# EAGLE schematic Circuit_Board_HM_1007_Interface (EAGLE 9.6.2)
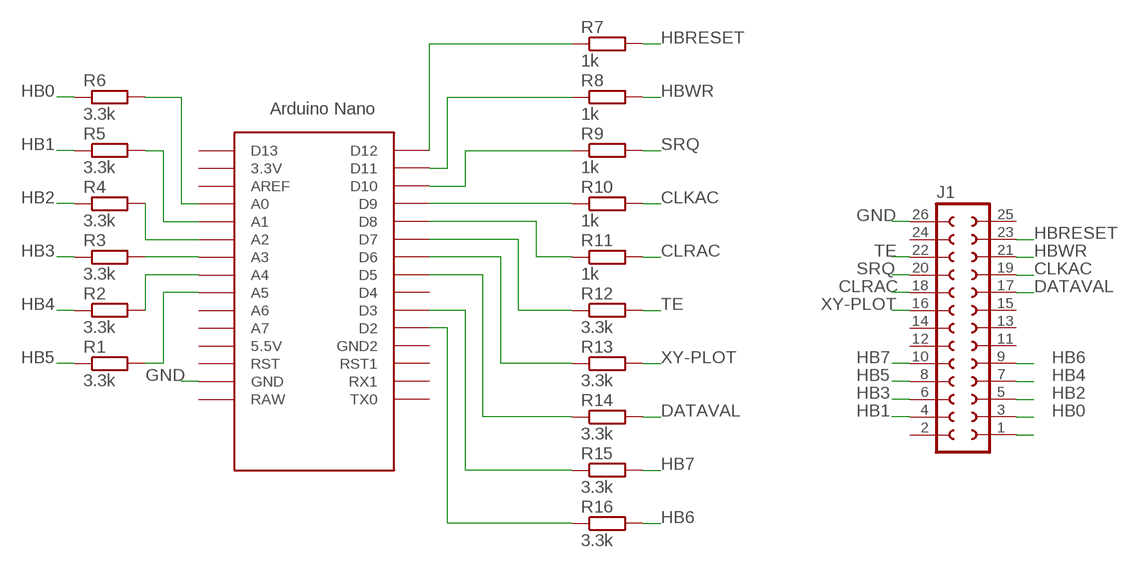
[diagram p0: schematic, sheet 1]

## Parts
J1  SOCKET-26V  [S26V]
R1  3.3k  R-EU_0204/7  [0204/7]
R2  3.3k  R-EU_0204/7  [0204/7]
R3  3.3k  R-EU_0204/7  [0204/7]
R4  3.3k  R-EU_0204/7  [0204/7]
R5  3.3k  R-EU_0204/7  [0204/7]
R6  3.3k  R-EU_0204/7  [0204/7]
R7  1k  R-EU_0204/7  [0204/7]
R8  1k  R-EU_0204/7  [0204/7]
R9  1k  R-EU_0204/7  [0204/7]
R10  1k  R-EU_0204/7  [0204/7]
R11  1k  R-EU_0204/7  [0204/7]
R12  3.3k  R-EU_0204/7  [0204/7]
R13  3.3k  R-EU_0204/7  [0204/7]
R14  3.3k  R-EU_0204/7  [0204/7]
R15  3.3k  R-EU_0204/7  [0204/7]
R16  3.3k  R-EU_0204/7  [0204/7]
U$1  NANO  [NANO]

## Nets
CLKAC: J1.19 R10.2
CLRAC: J1.18 R11.2
DATAVAL: J1.17 R14.2
GND: J1.26 U$1.GND
HB0: J1.3 R6.1
HB1: J1.4 R5.1
HB2: J1.5 R4.1
HB3: J1.6 R3.1
HB4: J1.7 R2.1
HB5: J1.8 R1.1
HB6: J1.9 R16.2
HB7: J1.10 R15.2
HBRESET: J1.23 R7.2
HBWR: J1.21 R8.2
N$1: R6.2 U$1.A0
N$2: R5.2 U$1.A1
N$3: R4.2 U$1.A2
N$4: R3.2 U$1.A3
N$5: R2.2 U$1.A4
N$6: R1.2 U$1.A5
N$7: J1.1
N$8: R16.1 U$1.D2
N$9: R15.1 U$1.D3
N$10: R14.1 U$1.D5
N$12: R13.1 U$1.D6
N$13: R12.1 U$1.D7
N$14: R11.1 U$1.D8
N$16: R10.1 U$1.D9
N$17: R7.1 U$1.D12
N$18: R8.1 U$1.D11
N$19: R9.1 U$1.D10
SRQ: J1.20 R9.2
TE: J1.22 R12.2
XY-PLOT: J1.16 R13.2
Unconnected: J1.2 J1.11 J1.12 J1.13 J1.14 J1.15 J1.24 J1.25 U$1.3.3V U$1.5V(5.5V) U$1.A6 U$1.A7 U$1.AREF U$1.D4 U$1.D13 U$1.GND1(GND2) U$1.ICSP1 U$1.ICSP2 U$1.ICSP3 U$1.ICSP4 U$1.ICSP5 U$1.ICSP6 U$1.RAW U$1.RST U$1.RST1 U$1.RX1 U$1.TX0

## Library data of the parts
J1 = con-3m-skt-header:SOCKET-26: 26 pin PCB Socket (3m 85xx/51xx)
R1-R16 = rcl:R-EU_: RESISTOR, European symbol; SPICEPREFIX: R
U$1 = Arduino-clone:NANO: Arduino Nano